# Altium schematic sheet Servo Motors.SchDoc
size A
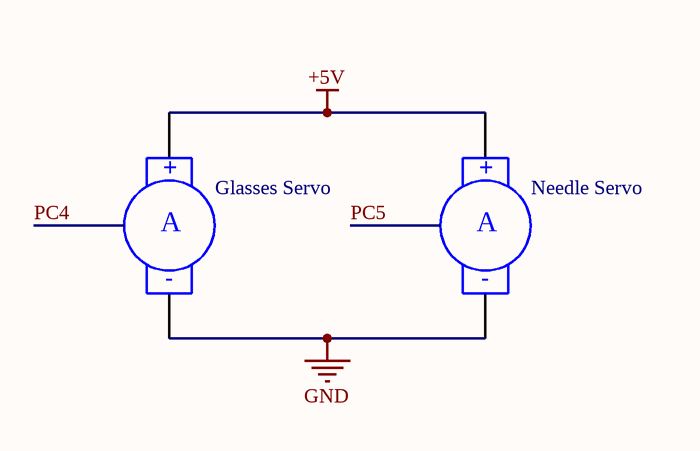
[diagram p0: Servo Motors.SchDoc]

## Parts
(Parts that share a designator on the sheet are numbered #1, #2 ... from top to bottom, then left to right.)
B?#1  Glasses Servo  [RAD-0.4]
B?#2  Needle Servo  [RAD-0.4]

## Nets
+5V: B?#1.1(+) B?#2.1(+)
GND: B?#1.2(-) B?#2.2(-)

## Notes on the sheet
- (in symbol Motor Servo) A

## Library data of the parts
B?#1 B?#2 = Motor Servo: Servo Motor; Published: 24-Mar-1999; LatestRevisionDate: 17-Jul-2002; LatestRevisionNote: Re-released for DXP Platform.; PackageReference: RAD-0.4; Publisher: Altium Limited; PackageDescription: Radial Cap, Thru-Hole; 2 Leads; 0.4 in Pin Spacing